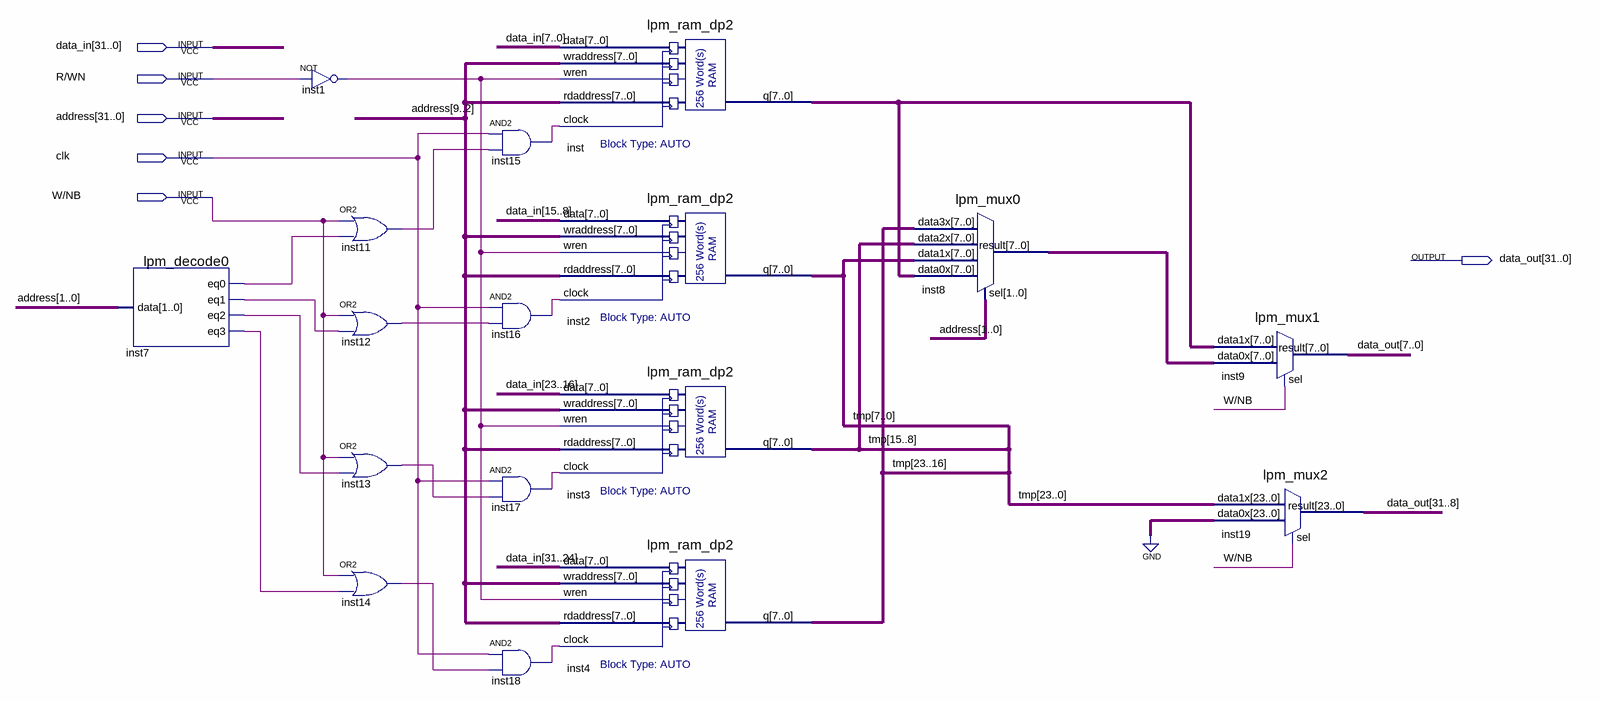
[diagram p0: schematic sheet]
// Quartus schematic data_MEM.bdf as structural Verilog: 17 symbols, 6 pins
module data_MEM (
  input  [31:0] data_in,
  input  \R/WN ,
  input  [31:0] address,
  input  clk,
  input  \W/NB ,
  output [31:0] data_out
);

  wire inst1_out, inst7_eq0, inst7_eq1, inst7_eq2, inst7_eq3, inst11_out, inst12_out, inst13_out, inst14_out,
       inst15_out, inst16_out, inst17_out, inst18_out;
  wire [7:0] inst8_result, inst_q;
  wire [23:0] tmp;

  lpm_decode0 inst7 (.data(address[1:0]), .eq0(inst7_eq0), .eq1(inst7_eq1), .eq2(inst7_eq2), .eq3(inst7_eq3));
  not inst1 (inst1_out, \R/WN );
  or inst11 (inst11_out, \W/NB , inst7_eq0);
  or inst12 (inst12_out, \W/NB , inst7_eq1);
  or inst13 (inst13_out, \W/NB , inst7_eq2);
  or inst14 (inst14_out, \W/NB , inst7_eq3);
  and inst15 (inst15_out, clk, inst11_out);
  and inst16 (inst16_out, clk, inst12_out);
  and inst17 (inst17_out, clk, inst13_out);
  and inst18 (inst18_out, clk, inst14_out);
  lpm_ram_dp2 inst (
    .data(data_in[7:0]), .wraddress(address[9:2]), .wren(inst1_out), .rdaddress(address[9:2]),
    .clock(inst15_out), .q(inst_q));
  lpm_ram_dp2 inst2 (
    .data(data_in[15:8]), .wraddress(address[9:2]), .wren(inst1_out), .rdaddress(address[9:2]),
    .clock(inst16_out), .q(tmp[7:0]));
  lpm_ram_dp2 inst3 (
    .data(data_in[23:16]), .wraddress(address[9:2]), .wren(inst1_out), .rdaddress(address[9:2]),
    .clock(inst17_out), .q(tmp[15:8]));
  lpm_ram_dp2 inst4 (
    .data(data_in[31:24]), .wraddress(address[9:2]), .wren(inst1_out), .rdaddress(address[9:2]),
    .clock(inst18_out), .q(tmp[23:16]));
  lpm_mux0 inst8 (
    .data3x(tmp[23:16]), .data2x(tmp[15:8]), .data1x(tmp[7:0]), .data0x(inst_q), .sel(address[1:0]),
    .result(inst8_result));
  lpm_mux1 inst9 (.data1x(inst_q), .data0x(inst8_result), .sel(\W/NB ), .result(data_out[7:0]));
  lpm_mux2 inst19 (.data1x(tmp), .data0x({24{1'b0}}), .sel(\W/NB ), .result(data_out[31:8]));
endmodule
